# EAGLE schematic ATTiny85 5LED VUSB (EAGLE 8.3.2)
CNAME: TinyPoV 5 LED; CREVISION: 1; DESIGNER: Filippo Sallemi
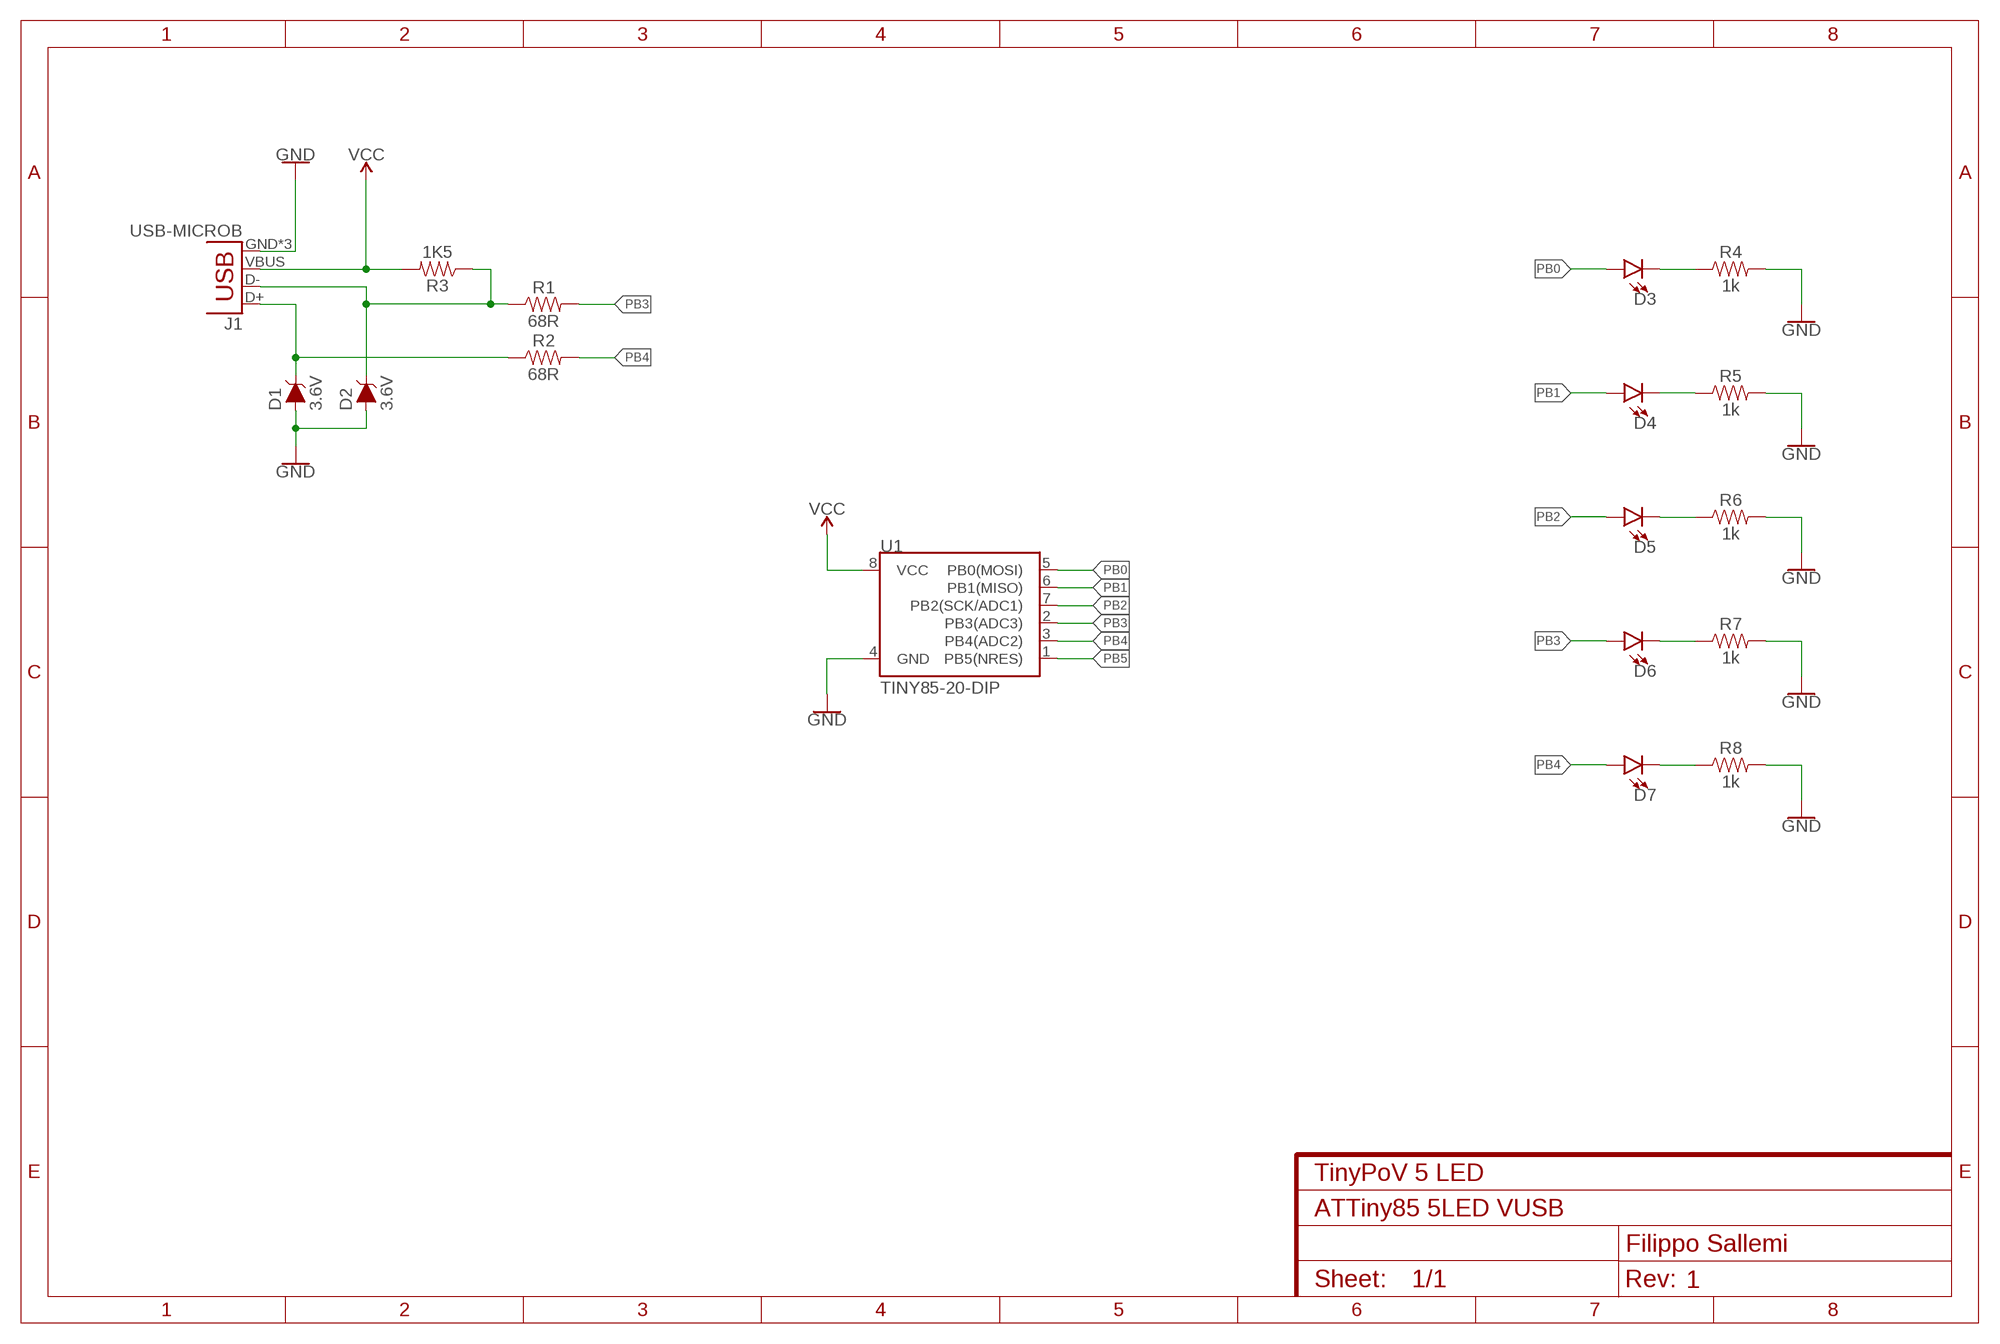
[diagram p0: schematic, sheet 1]

## Parts
D1  3.6V  DIODE-ZENER-BZT52C3V6S  [SOD-323]
D2  3.6V  DIODE-ZENER-BZT52C3V6S  [SOD-323]
D3  LED5MM  [LED_5MM]
D4  LED5MM  [LED_5MM]
D5  LED5MM  [LED_5MM]
D6  LED5MM  [LED_5MM]
D7  LED5MM  [LED_5MM]
J1  USB-MICROB  [USB-MICROB]
R1  68R  RESISTORAXIAL-0.3  [AXIAL-0.3]
R2  68R  RESISTORAXIAL-0.3  [AXIAL-0.3]
R3  1K5  RESISTORAXIAL-0.3  [AXIAL-0.3]
R4  1k  1KOHM-HORIZ-1/4W-5%  [AXIAL-0.3]
R5  1k  1KOHM-HORIZ-1/4W-5%  [AXIAL-0.3]
R6  1k  1KOHM-HORIZ-1/4W-5%  [AXIAL-0.3]
R7  1k  1KOHM-HORIZ-1/4W-5%  [AXIAL-0.3]
R8  1k  1KOHM-HORIZ-1/4W-5%  [AXIAL-0.3]
U1  TINY85-20-DIP  ATTINY45TINY85-20-DIP  [DIP08_MCU]

## Nets
GND: D1.A D2.A J1.GND J1.MT1(GND) J1.MT2(GND) R4.P$2 R5.P$2 R6.P$2 R7.P$2 R8.P$2 U1.4(GND)
N$1: D2.C J1.D- R1.P$1 R3.P$1
N$2: D1.C J1.D+ R2.P$1
N$3: D3.K(C) R4.P$1
N$4: D4.K(C) R5.P$1
N$5: D5.K(C) R6.P$1
N$6: D6.K(C) R7.P$1
N$7: D7.K(C) R8.P$1
PB0: D3.A U1.5(PB0(MOSI))
PB1: D4.A U1.6(PB1(MISO))
PB2: D5.A U1.7(PB2(SCK/ADC1))
PB3: D6.A R1.P$2 U1.2(PB3(ADC3))
PB4: D7.A R2.P$2 U1.3(PB4(ADC2))
PB5: U1.1(PB5(NRES))
VCC: J1.VBUS R3.P$2 U1.8(VCC)

## Library data of the parts
D1 D2 = SparkFun-DiscreteSemi:DIODE-ZENER: Zener Diode A Zener diode allows current to flow from its anode to its cathode like a normal semiconductor diode, but it also permits current to flow in the reverse direction when its "Zener voltage" is reached. - WIkipedia; PROD_ID: DIO-08199
D3-D7 = SparkFun-LED:LED: LED (Generic) Standard schematic elements and footprints for 5mm, 3mm, 1206, and 0603 sized LEDs. Generic LEDs with no color specified.
J1 = SparkFun-Retired:USB: USB Connectors USB-B-PTH is fully proven SKU : PRT-00139/CONN-08278 USB-miniB is fully proven SKU : PRT-00587 USB-A-PCB is untested. USB-A-H is throughly reviewed, but untested. Spark Fun Electronics SKU : PRT-00437 USB-B-SMT is throughly reviewed, but untested. Needs silkscreen touching up. USB-A-S has not been used/tested USB-MB-H has not been used/tested USB-MICROB has been used. CONN-09505; PROD_ID: CONN-09505
R1-R3 = SparkFun-Resistors:RESISTOR: Generic Resistor Package
R4-R8 = SparkFun-Resistors:1KOHM: 1kΩ resistor A resistor is a passive two-terminal electrical component that implements electrical resistance as a circuit element. Resistors act to reduce current flow, and, at the same time, act to lower voltage levels within circuits. - Wikipedia; PROD_ID: RES-08380
U1 = SparkFun-Retired:ATTINY45: Atmel 8-pin 2/4/8kB flash uC Retired; PROD_ID: IC-09445